# EAGLE design battery-board (EAGLE 6.5.0)
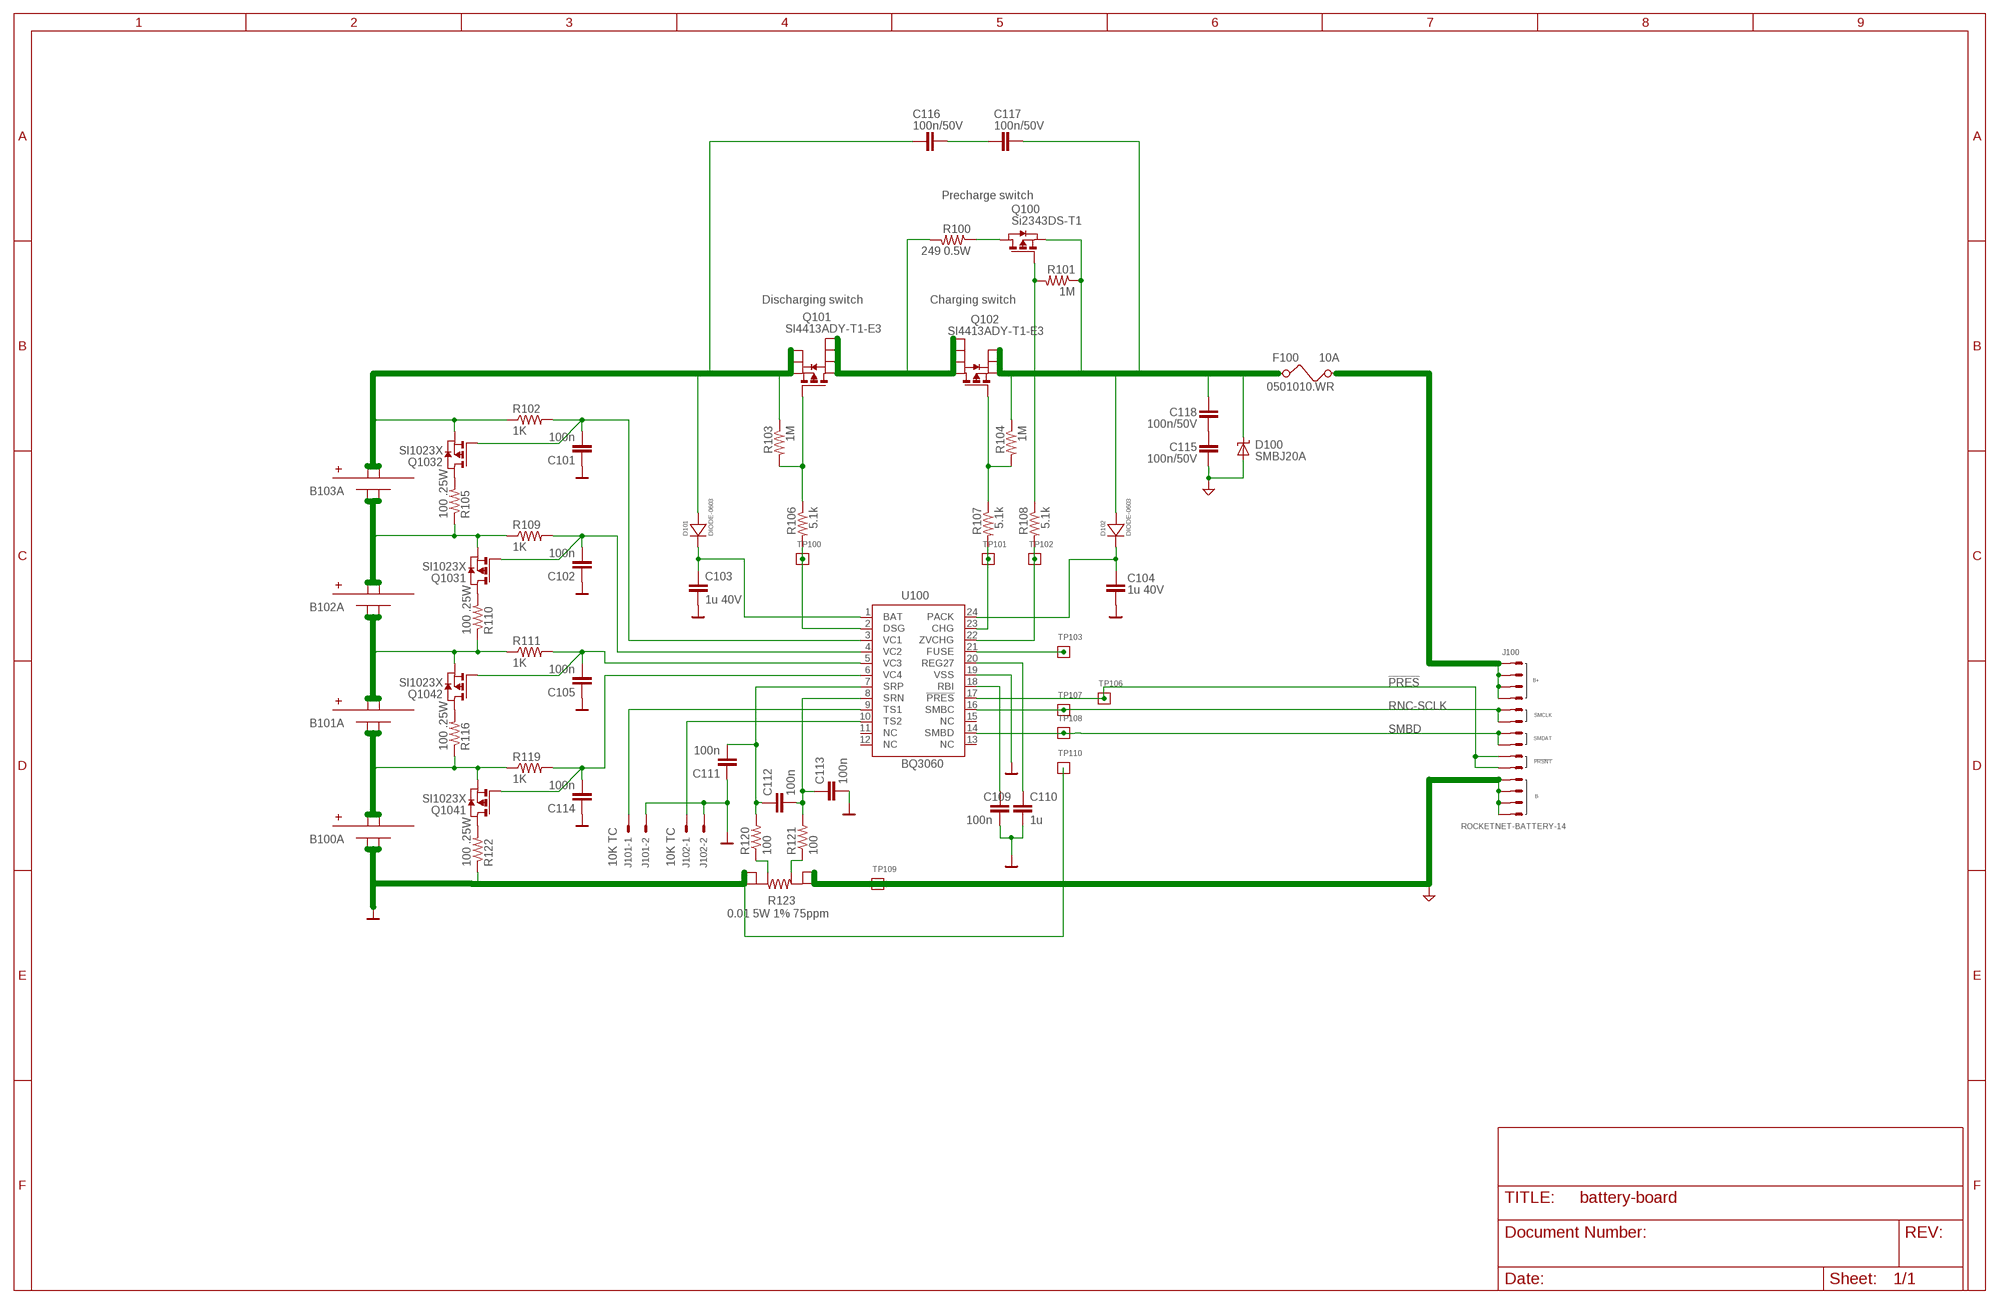
[diagram p0: schematic, sheet 1]

## Parts
B100A  LIPO-8AHR  [LIPO-8AHR-PAC]
B101A  LIPO-8AHR  [LIPO-8AHR-PAC]
B102A  LIPO-8AHR  [LIPO-8AHR-PAC]
B103A  LIPO-8AHR  [LIPO-8AHR-PAC]
C101  100n  C-EU0603-B-NOSILK  [0603-B-NOSILK]
C102  100n  C-EU0603-B-NOSILK  [0603-B-NOSILK]
C103  1u 40V  C-EU0603-B-NOSILK  [0603-B-NOSILK]
C104  1u 40V  C-EU0603-B-NOSILK  [0603-B-NOSILK]
C105  100n  C-EU0603-B-NOSILK  [0603-B-NOSILK]
C109  100n  C-EU0603-B-NOSILK  [0603-B-NOSILK]
C110  1u  C-EU0603-B-NOSILK  [0603-B-NOSILK]
C111  100n  C-EU0603-B-NOSILK  [0603-B-NOSILK]
C112  100n  C-EU0603-B-NOSILK  [0603-B-NOSILK]
C113  100n  C-EU0603-B-NOSILK  [0603-B-NOSILK]
C114  100n  C-EU0603-B-NOSILK  [0603-B-NOSILK]
C115  100n/50V  C-EU0603-B-NOSILK  [0603-B-NOSILK]
C116  100n/50V  C-EU0603-B-NOSILK  [0603-B-NOSILK]
C117  100n/50V  C-EU0603-B-NOSILK  [0603-B-NOSILK]
C118  100n/50V  C-EU0603-B-NOSILK  [0603-B-NOSILK]
D100  SMBJ20A  SUPPRESSOR-SMBJ  [SMBJ]
D101  DIODE-0603  [0603-B-NOSILK-DIODE]
D102  DIODE-0603  [0603-B-NOSILK-DIODE]
F100  0501010.WR  FUSE1206  [1206]
J100  ROCKETNET-BATTERY-14  [ROCKETNET-M-14]
J101  87758-0216  [87758-0216]
J102  87758-0216  [87758-0216]
Q100  Si2343DS-T1  NTR4101P  [SOT23]
Q101  SI4413ADY-T1-E3  SI4435DDY  [SO-8]
Q102  SI4413ADY-T1-E3  SI4435DDY  [SO-8]
Q103  SI1023X  [SOT-563]
Q104  SI1023X  [SOT-563]
R100  249 0.5W  R-US_1206-B  [1206-B]
R101  1M  R-US_0603-B-NOSILK  [0603-B-NOSILK]
R102  1K  R-US_0603-B-NOSILK  [0603-B-NOSILK]
R103  1M  R-US_0603-B-NOSILK  [0603-B-NOSILK]
R104  1M  R-US_0603-B-NOSILK  [0603-B-NOSILK]
R105  100 .25W  R-US_0603-B-NOSILK  [0603-B-NOSILK]
R106  5.1k  R-US_0603-B-NOSILK  [0603-B-NOSILK]
R107  5.1k  R-US_0603-B-NOSILK  [0603-B-NOSILK]
R108  5.1k  R-US_0603-B-NOSILK  [0603-B-NOSILK]
R109  1K  R-US_0603-B-NOSILK  [0603-B-NOSILK]
R110  100 .25W  R-US_0603-B-NOSILK  [0603-B-NOSILK]
R111  1K  R-US_0603-B-NOSILK  [0603-B-NOSILK]
R116  100 .25W  R-US_0603-B-NOSILK  [0603-B-NOSILK]
R119  1K  R-US_0603-B-NOSILK  [0603-B-NOSILK]
R120  100  R-US_0603-B-NOSILK  [0603-B-NOSILK]
R121  100  R-US_0603-B-NOSILK  [0603-B-NOSILK]
R122  100 .25W  R-US_0603-B-NOSILK  [0603-B-NOSILK]
R123  0.01 5W 1% 75ppm  R-US-2818  [VISHAY-2818]
TP100  TEST-POINT  [2MM-TEST-POINT]
TP101  TEST-POINT  [2MM-TEST-POINT]
TP102  TEST-POINT  [2MM-TEST-POINT]
TP103  TEST-POINT  [2MM-TEST-POINT]
TP106  TEST-POINT  [2MM-TEST-POINT]
TP107  TEST-POINT  [2MM-TEST-POINT]
TP108  TEST-POINT  [2MM-TEST-POINT]
TP109  TEST-POINT  [2MM-TEST-POINT]
TP110  TEST-POINT  [2MM-TEST-POINT]
U100  BQ3060PW  [PW-R-PDSO-G24]

## Nets
!PRES: J100.!PRSNT@9(!PRSNT) J100.!PRSNT@10(!PRSNT) TP106.1 U100.17(!PRES)
B12: B100A.B+@1(B+) B100A.B+@2(B+) B101A.B-@1(B-) B101A.B-@2(B-) Q104.1(1:S) R116.1 R119.1
B23: B101A.B+@1(B+) B101A.B+@2(B+) B102A.B-@1(B-) B102A.B-@2(B-) Q104.4(2:S) R110.1 R111.1
B34: B102A.B+@1(B+) B102A.B+@2(B+) B103A.B-@1(B-) B103A.B-@2(B-) Q103.1(1:S) R105.1 R109.1
B+: B103A.B+@1(B+) B103A.B+@2(B+) C116.1 D101.ANODE Q101.1(S) Q101.2(S) Q101.3(S) Q103.4(2:S) R102.1 R103.1
BAR_GND: B100A.B-@1(B-) B100A.B-@2(B-) C101.1 C102.1 C103.2 C104.2 C105.1 C109.2 C110.2 C111.1 C113.2 C114.1 J101.2 J102.2 R122.1 R123.1@1 R123.1@2 TP110.1 U100.19(VSS) ; supply symbol labelled SUP_GND_BAR
BAT: C103.1 D101.CATHODE U100.1(BAT)
FUSE: TP103.1 U100.21(FUSE)
N$3: R120.1 R123.K1
N$5: C111.2 C112.1 R120.2 U100.7(SRP)
N$6: C112.2 C113.1 R121.2 U100.8(SRN)
N$9: Q104.3(2:D) R116.2
N$10: C102.2 Q103.2(1:G) R109.2 U100.4(VC2)
N$11: C105.2 Q104.5(2:G) R111.2 U100.5(VC3)
N$12: C114.2 Q104.2(1:G) R119.2 U100.6(VC4)
N$13: C109.1 U100.18(RBI)
N$14: C110.1 U100.20(REG27)
N$15: C115.1 C118.2
N$16: R121.1 R123.K2
N$18: Q104.6(1:D) R122.2
N$19: C101.2 Q103.5(2:G) R102.2 U100.3(VC1)
N$20: Q103.6(1:D) R110.2
N$21: Q103.3(2:D) R105.2
N$27: R106.2 TP100.1 U100.2(DSG)
N$28: Q101.5(D) Q101.6(D) Q101.7(D) Q101.8(D) Q102.5(D) Q102.6(D) Q102.7(D) Q102.8(D) R100.2
N$29: R108.2 TP102.1 U100.22(ZVCHG)
N$30: R107.2 TP101.1 U100.23(CHG)
N$34: Q101.4(G) R103.2 R106.1
N$36: Q102.4(G) R104.2 R107.1
N$39: Q100.1(G) R101.2 R108.1
N$40: C116.2 C117.1
PACK: C104.1 D102.CATHODE U100.24(PACK)
PACK+: F100.1 J100.B+@1(B+) J100.B+@2(B+) J100.B+@3(B+) J100.B+@4(B+)
PACK+PREFUSE: C117.2 C118.1 D100.C D102.ANODE F100.2 Q100.2(S) Q102.1(S) Q102.2(S) Q102.3(S) R101.1 R104.1
PRE-CHARGE: Q100.3(D) R100.1
RNC-SCLK: J100.SMCLK@3(SMCLK) J100.SMCLK@4(SMCLK) TP107.1 U100.16(SMBC)
SMBD: J100.SMDAT@7(SMDAT) J100.SMDAT@8(SMDAT) TP108.1 U100.14(SMBD)
T1: J101.1 U100.9(TS1)
T2: J102.1 U100.10(TS2)
TRIANGLE_GND: C115.2 D100.A J100.B-@11(B-) J100.B-@12(B-) J100.B-@13(B-) J100.B-@14(B-) R123.2@1 R123.2@2 TP109.1 ; supply symbol labelled SUP_GND_TRIANGLE
Unconnected: U100.11(NC) U100.12(NC) U100.13(NC) U100.15(NC)

## Notes on the sheet
- Precharge switch
- Discharging switch | Charging switch
- 10A
- 10K TC | 10K TC

## Library data of the parts
B100A B101A B102A B103A = battery:LIPO-8AHR
C101-C105 C109-C118 = rcl_custom:C-EU: CAPACITOR, European symbol
D100 = diode:SUPPRESSOR-: Suppressor diode
D101 D102 = diode-0603:DIODE-0603
F100 = psas:FUSE: Fuse; DK: F2919CT-ND
J100 = rocketnet-connector:ROCKETNET-BATTERY-14
J101 J102 = con-molex:87758-0216: 2 Pin - 2mm Dual Row Single Wafer, Vertical T/H HDR Source: http://www.molex.com/pdm_docs/sd/877580616_sd.pdf; MPN: 87758-0216; OC_FARNELL: unknown; OC_NEWARK: 94M1513
Q100 = Tova:NTR4101P
Q101 Q102 = si4435ddy:SI4435DDY
Q103 Q104 = si1023x:SI1023X
R100-R111 R116 R119-R122 = rcl_custom:R-US_: RESISTOR, American symbol
R123 = shunt:R-US-2818
TP100-TP103 TP106-TP110 = Tova:TEST-POINT
U100 = bq3060:BQ3060

## Board
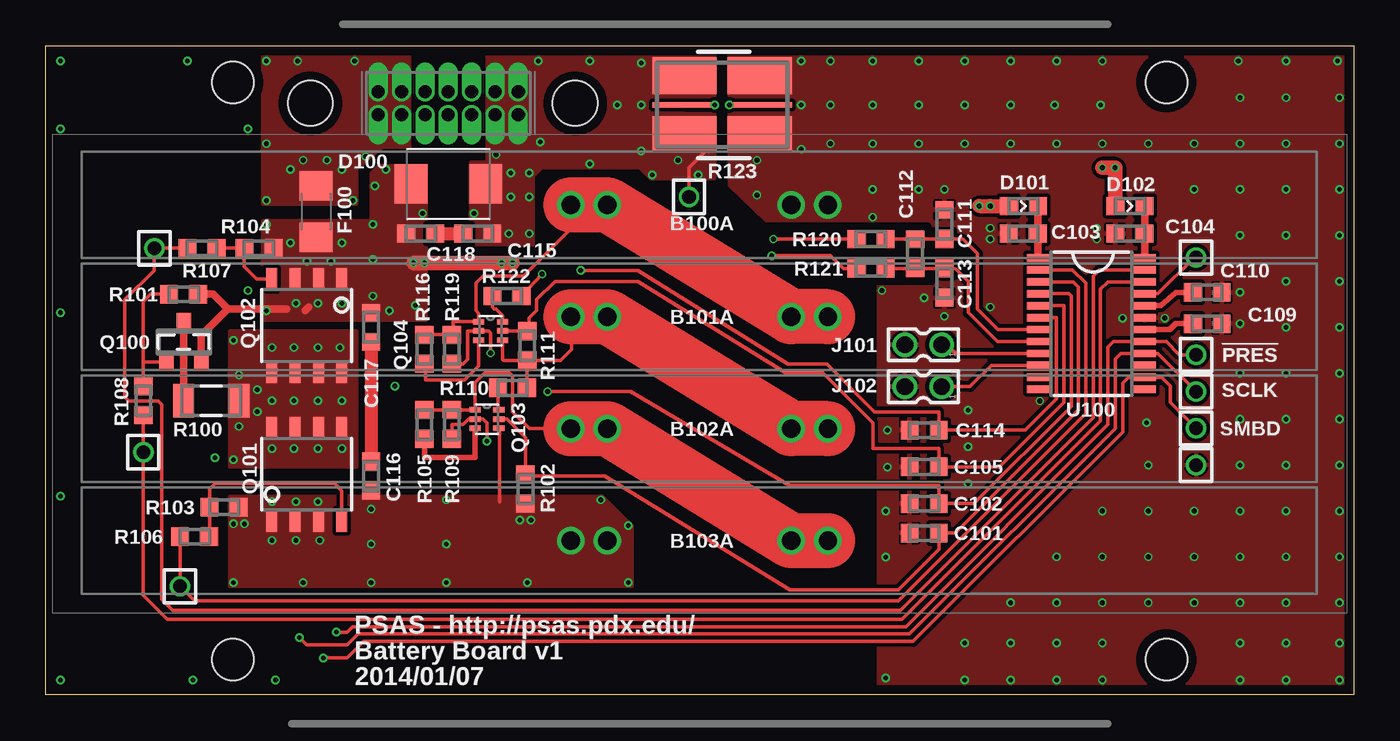
[diagram p1: board, top side]
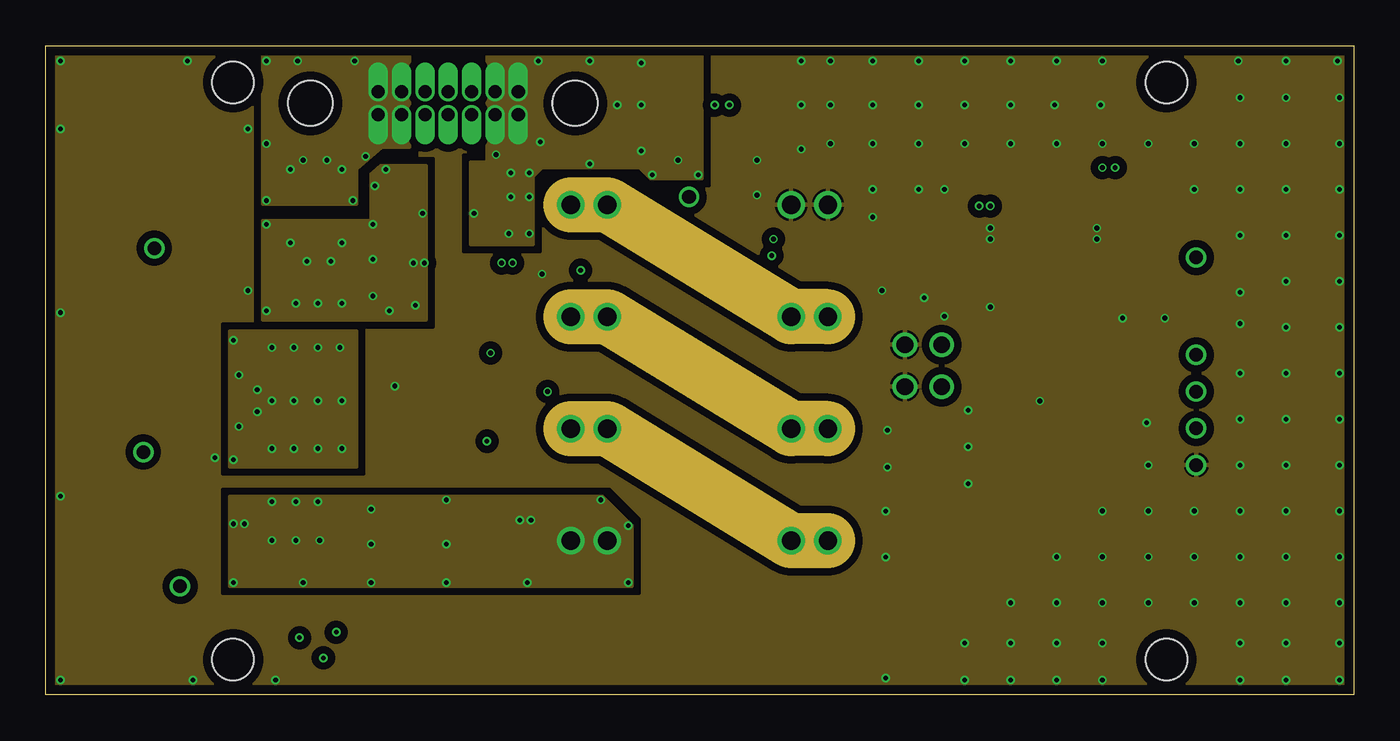
[diagram p2: board, inner layer Route2]
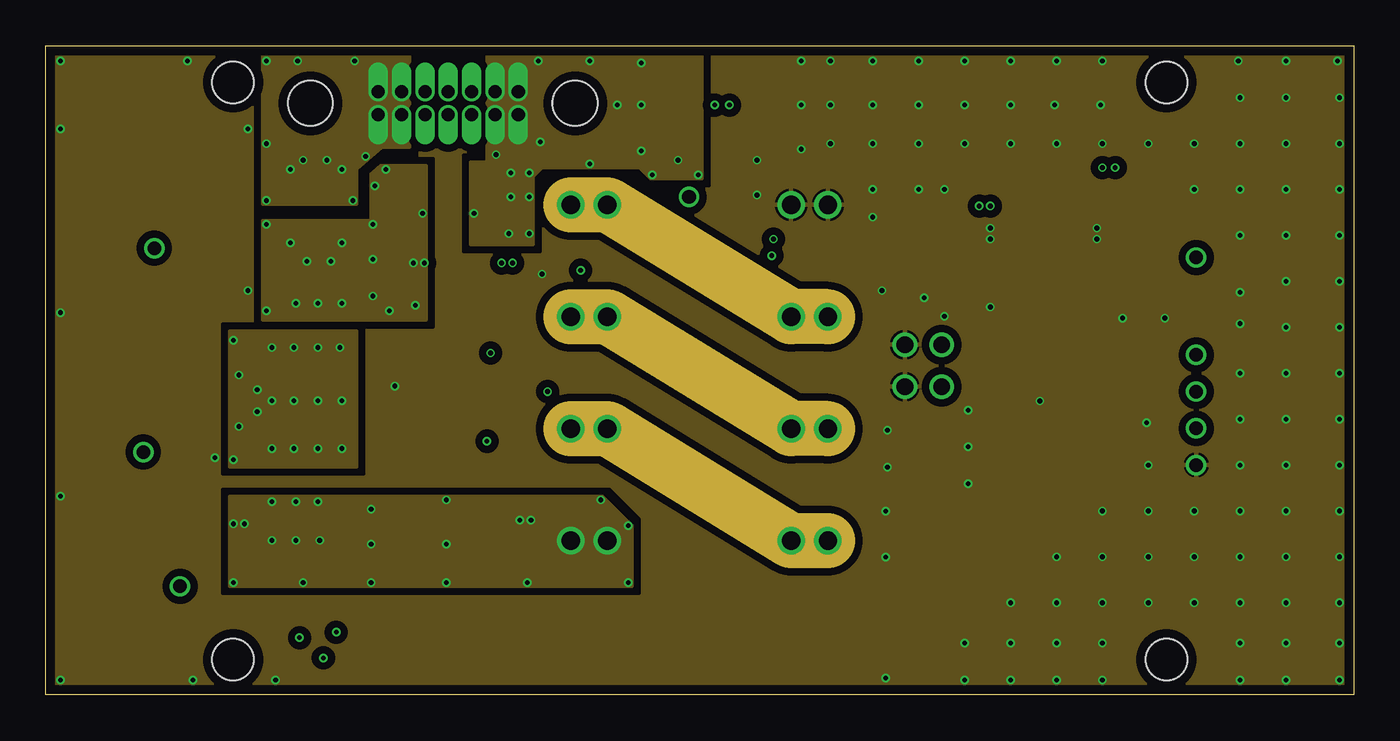
[diagram p3: board, inner layer Route3]
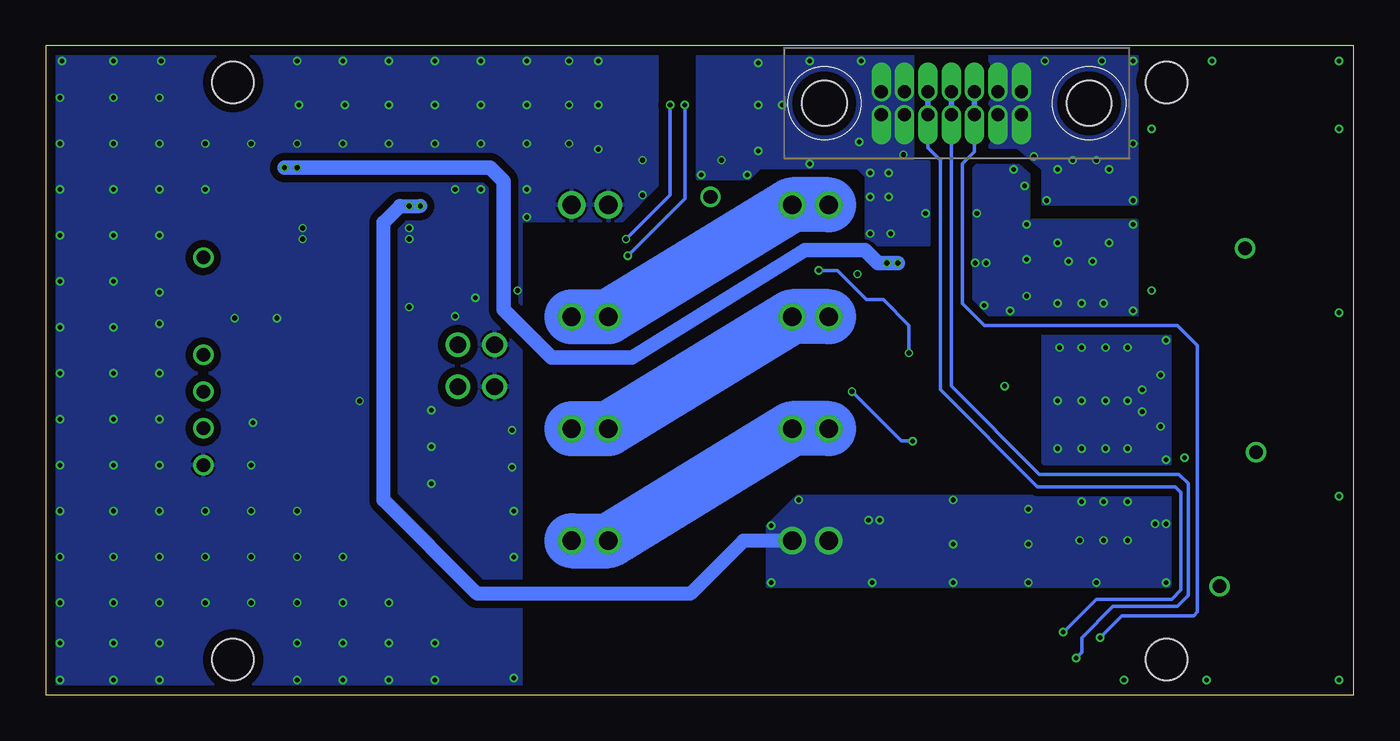
[diagram p4: board, bottom side, seen from below]

Size 71.17 x 35.32 mm. Coordinates in mm from the lower left corner, seen from the top.
Outline: 0,0 0,35.32 71.17,35.32 71.17,0 0,0
Copper layers (1+2*3+16): Top 0.035559375mm / dielectric 0.17018125mm / Route2 0.01778125mm / dielectric 47mil / Route3 0.01778125mm / dielectric 0.17018125mm / Bottom 0.035559375mm
Design rules "OSH-Park-4-layer *": minimum track width 5mil, minimum drill 10mil, track to track 5mil, track to pad 5mil, pad to pad 5mil, via to via 5mil, smd to smd 5mil, copper to edge 20mil, drill to drill 5mil, minimum pad ring 4mil, minimum via ring 4mil, stop-mask expansion 4mil, vias tented up to drill 10mil, thermal gap 5mil
Holes 2.26 mm at 60.99,1.91 10.19,1.91 60.99,33.34 10.19,33.34
tKeepout: area 59,31.3 to 63,35.4; area 8.2,31.3 to 12.2,35.4; area 8.2,-0.1 to 12.2,3.9; area 59,-0.1 to 63,3.9
bKeepout: area 0,30.5 to 71.2,35.2; area 0,0 to 71.2,4.4
tRestrict: area 44.6,25.4 to 48,25.5; area 44.8,22.5 to 48.2,22.6

### Footprints (pad centres in the part's own frame; a part is rotated, then mirrored left to right if it is on the bottom)
LIPO-8AHR-PAC = drill 1: B+@1 5,0; B+@2 7,0; B-@1 -5,0; B-@2 -7,0
0603-B-NOSILK = smd 0.95 x 1: 1 -0.8,0; 2 0.8,0
SMBJ = smd 1.78 x 2.16: A 2.04,0; C -2.03,0
0603-B-NOSILK-DIODE = smd 0.95 x 1: ANODE -0.8,0; CATHODE 0.8,0
1206 = smd 1.6 x 1.8: 1 -1.4,0; 2 1.4,0
ROCKETNET-M-14 = drill 0.71 pad 0.95 offset: !PRSNT@9 1.27,-0.635; !PRSNT@10 1.27,0.635; B+@1 -3.81,-0.635; B+@2 -3.81,0.635; B+@3 -2.54,-0.635; B+@4 -2.54,0.635; B-@11 2.54,-0.635; B-@12 2.54,0.635; B-@13 3.81,-0.635; B-@14 3.81,0.635; SMCLK@3 -1.27,-0.635; SMCLK@4 -1.27,0.635; SMDAT@7 0,-0.635; SMDAT@8 0,0.635 | hole 2.438: 6.9,0; -7.5,0
87758-0216 = drill 0.9 pad 1.27: 1 0,-1; 2 0,1
SOT23 = smd 0.787 x 0.889: 1 -0.953,-1.143; 2 0.953,-1.143; 3 0,1.143
SO-8 = smd 0.6 x 1.2: 1 -1.905,-2.527; 2 -0.635,-2.527; 3 0.635,-2.527; 4 1.905,-2.527; 5 1.905,2.527; 6 0.635,2.527; 7 -0.635,2.527; 8 -1.905,2.527
SOT-563 = smd 0.3 x 0.6: 1 -0.5,-0.65; 2 0,-0.65; 3 0.5,-0.65; 4 0.5,0.65; 5 0,0.65; 6 -0.5,0.65
1206-B = smd 1.15 x 1.8: 1 -1.5,0; 2 1.5,0
VISHAY-2818 = smd 3.5 x 2: 1@1 -2.055,-1.6; 1@2 -2.055,1.6; 2@1 2.045,-1.6; 2@2 2.045,1.6 | smd 3.5 x 0.3: K1 -2.055,0; K2 2.045,0
2MM-TEST-POINT = drill 0.737: 1 0,0
PW-R-PDSO-G24 = smd 0.4 x 1.2: 1 -3.575,-2.9; 2 -2.925,-2.9; 3 -2.275,-2.9; 4 -1.625,-2.9; 5 -0.975,-2.9; 6 -0.325,-2.9; 7 0.325,-2.9; 8 0.975,-2.9; 9 1.625,-2.9; 10 2.275,-2.9; 11 2.925,-2.9; 12 3.575,-2.9; 13 3.575,2.9; 14 2.925,2.9; 15 2.275,2.9; 16 1.625,2.9; 17 0.975,2.9; 18 0.325,2.9; 19 -0.325,2.9; 20 -0.975,2.9; 21 -1.625,2.9; 22 -2.275,2.9; 23 -2.925,2.9; 24 -3.575,2.9

### Placement (x,y rotation side)
B100A  35.56,26.67 180 top
B101A  35.56,20.57 180 top
B102A  35.56,14.48 180 top
B103A  35.56,8.38 180 top
C101  47.8,8.8 0 top
C102  47.8,10.4 0 top
C103  53.2,25.1 180 top
C104  59,25.1 180 top
C105  47.8,12.4 0 top
C109  63.2,20.2 0 top
C110  63.2,21.9 0 top
C111  48.9,25.6 270 top
C112  47.3,24 270 top
C113  48.9,22.4 270 top
C114  47.8,14.4 0 top
C115  23.5,25.1 0 top
C116  17.7,11.9 90 top
C117  17.7,20 90 top
C118  20.4,25.1 0 top
D100  21.9,27.8 0 top
D101  53.2,26.6 0 top
D102  59,26.6 0 top
F100  14.7,26.3 270 top
J100  21.9,32.2 0 top
J101  47.75,19.05 90 top
J102  47.75,16.76 90 top
Q100  7.5,19.2 0 top
Q101  14.2,12 0 top
Q102  14.2,20.1 180 top
Q103  24,15 270 top
Q104  24.2,19.8 270 top
R100  9,16 0 top
R101  7.5,21.8 180 top
R102  26.1,11.2 90 top
R103  9.7,10.2 180 top
R104  11.6,24.3 180 top
R105  20.6,14.7 270 top
R106  8.1,8.6 180 top
R107  8.5,24.3 180 top
R108  5.3,16 270 top
R109  22.1,14.7 270 top
R110  25.4,16.7 180 top
R111  26.2,19 90 top
R116  20.6,18.8 270 top
R119  22.1,18.8 270 top
R120  44.9,24.8 0 top
R121  44.9,23.2 0 top
R122  25.1,21.7 180 top
R123  36.8,32.1 180 top
TP100  7.3,5.9 0 top
TP101  5.9,24.3 0 top
TP102  5.3,13.2 0 top
TP103  62.6,23.8 0 top
TP106  62.6,18.5 0 top
TP107  62.6,16.5 0 top
TP108  62.6,14.5 0 top
TP109  35,27.1 0 top
TP110  62.6,12.5 0 top
U100  56.9,20.2 270 top

### Tracks (layer width: path | path; a pad name or v marks a point on that pad's centre or on a via)
!PRES  (via drill 0.25)
  Top 0.2: 57.8,14.7 46.8,3.7 16.7,3.7 16.4,3.4 v15.8,3.4
  Top 0.203: TP106.1 61.7,18.5 60.98,19.23 U100.17 58.1,19.23 57.8,18.93 57.8,14.7
  Bottom 0.203: J100.!PRSNT@9 23.17,29.77 22.5,29.1 22.5,16.6 17.2,11.3 9.7,11.3 9.4,11 9.4,5.7 9.9,5.2 14,5.2 v15.8,3.4
  Bottom 0.3: J100.!PRSNT@10 J100.!PRSNT@9
B12
  Top 0.2: 22.16,20.3 22.16,19.66 R119.1
  Top 0.203: 22.13,19.6 R119.1 R116.1 | 22.16,20.3 Q104.1 23.55,20.75 23.4,20.9 23.4,22.4 23.8,22.8 26,22.8 28.6,25.4 28.56,25.4 B100A.B+@2
  Top 3: B101A.B-@2 B101A.B-@1 B100A.B+@1 B100A.B+@2
  Route2 3: B100A.B+@2 B100A.B+@1 B101A.B-@1 B101A.B-@2
  Route3 3: B100A.B+@2 B100A.B+@1 B101A.B-@1 B101A.B-@2
  Bottom 3: B100A.B+@2 B100A.B+@1 B101A.B-@1 B101A.B-@2
B23
  Top 0.203: 24.85,18.35 Q104.4 24.85,18.3 arc90 24.95,18.2 R111.1 | R111.1 28,18.2 28.6,18.8 28.6,20.53 B101A.B+@2 | R110.1 R111.1
  Top 3: B102A.B-@2 B102A.B-@1 B101A.B+@1 B101A.B+@2
  Route2 3: B101A.B+@2 B101A.B+@1 B102A.B-@1 B102A.B-@2
  Route3 3: B101A.B+@2 B101A.B+@1 B102A.B-@1 B102A.B-@2
  Bottom 3: B101A.B+@2 B101A.B+@1 B102A.B-@1 B102A.B-@2
B34
  Top 0.203: R105.1 R109.1 Q103.1 23.35,17 23.87,17.52 25.24,17.52 25.4,17.36 25.4,15.4 26.32,14.48 B102A.B+@2
  Top 3: B103A.B-@2 B103A.B-@1 B102A.B+@1 B102A.B+@2
  Route2 3: B103A.B-@2 B103A.B-@1 B102A.B+@1 B102A.B+@2
  Route3 3: B103A.B-@2 B103A.B-@1 B102A.B+@1 B102A.B+@2
  Bottom 3: B103A.B-@2 B103A.B-@1 B102A.B+@1 B102A.B+@2
B+  (via drill 0.25)
  Top 0.203: R102.1 26.1,10.6 26.2,10.5 | Q103.4 24.7,14.45 24.7,10.5
  Top 0.762: v50.8,26.6 v51.4,26.6 D101.ANODE
  Bottom 0.762: B103A.B+@1 33.22,8.38 36.1,5.5 47.7,5.5 52.8,10.6 52.8,25.7 51.9,26.6 v50.8,26.6
  other vias: 10.2,9.3 10.8,9.3 31.7,9.2 31.7,6.1 26.4,9.5 25.8,9.5 10.2,6.1 14.9,8.4 14.8,10.5 13.6,8.4 13.6,10.5 12.3,8.4 12.3,10.5 17.7,10.1 14,6.1 17.7,6.1 21.8,6.1 26.2,6.1 21.8,10.6 21.8,8.2 17.7,8.2 30.2,10.6
  pour Top (isolate 0.2, no thermals): 10,5.9 10,10.8 30.3,10.8 31.9,9.2 31.9,5.9
  pour Route2 (isolate 0.4, rank 3, no thermals): 10,5.9 10,10.8 30.3,10.8 31.9,9.2 31.9,5.9
  pour Route3 (isolate 0.4, rank 3, no thermals): 10,5.9 10,10.8 30.3,10.8 31.9,9.2 31.9,5.9
  pour Bottom (isolate 0.4, no thermals): 10,5.9 10,10.8 30.3,10.8 31.9,9.2 31.9,5.9
BAR_GND  (via drill 0.25)
  Top 0.203: R122.1 v27,22.9
  other vias: 59.9,14.8 51.4,24.8 45.7,0.9 45.7,7.49 45.8,12.39 45.8,14.39 42.7,32.1 45,32.1 47.5,32.1 50,32.1 52.5,32.1 54.9,32.1 57.4,32.1 65,32.5 67.5,32.5 67.5,30 65,30 62.5,30 60,30 57.5,30 55,30 52.5,30 50,30 47.5,30 45,30 42.7,30 45,27.5 47.5,27.5 62.5,27.5 65,27.5 67.5,27.5 67.5,25 65,25 67.5,22.5 67.5,20 58.6,20.5 67.5,17.5 65,17.5 65,15 67.5,15 67.5,12.5 65,12.5 60,12.5 57.5,10 60,10 62.5,10 65,10 67.5,10 67.5,7.5 65,7.5 62.5,7.5 60,7.5 57.5,7.5 55,7.5 52.5,5 55,5 57.5,5 60,5 62.5,5 65,5 67.5,5 67.5,2.8 65,2.8 57.5,2.8 55,2.8 52.5,2.8 50,2.8 45.7,9.99 50.2,15.49 50.2,13.49 50.2,11.49 45.5,22 48.9,20.6 57.2,25.4 65,21.9 65,20.2 57.2,24.8 51.4,25.4 60.9,20.5 48.9,27.5 41.1,34.5 42.7,34.5 45,34.5 41.1,32.1 41.1,29.7 38.7,29.1 0.8,0.8 0.8,34.5 7.7,34.5 11,30.8 19,16.8 8,0.8 12.5,0.8 47.5,34.5 50,34.5 52.5,34.5 55,34.5 57.5,34.5 45,26 38.7,27.2 64.9,34.5 67.5,34.5 70.3,34.5 70.4,32.5 70.4,30 70.4,27.5 70.4,25 70.4,22.5 70.4,20 70.4,17.5 70.4,15 70.4,12.5 70.4,10 70.4,7.5 70.4,5 70.4,2.8 67.5,0.8 65,0.8 57.5,0.8 55,0.8 52.5,0.8 50,0.8 70.4,0.8 54.1,15.99 47.8,21.6 51.4,21.1 11,22 9.2,12.9 0.8,10.8 0.8,20.8 0.8,30.8
  pour Route2 (isolate 0.4, rank 6): 0,35.3 0,0 71.2,0 71.2,35.32
  pour Top (isolate 0.2, no thermals): 39.2,27.7 43.7,27.7 43.7,25.8 39.2,25.8
  pour Route3 (isolate 0.4, rank 6): 71.2,35.3 0,35.3 0,0 71.2,0
  pour Top (isolate 0.2, rank 6): 39.2,25.8 40.32,25.81 arc0 45.3,25.8 45.3,0 71.2,0 71.2,35.3 37.2,35.3 37.2,27.7
  pour Bottom (isolate 0.4, rank 6): 39.8,25.8 40.32,25.81 45.3,25.8 45.3,0 71.2,0 71.2,35.3 37.9,35.3 37.9,27.7
BAT
  Top 0.4: D101.CATHODE C103.1 U100.1
FUSE
  Top 0.203: U100.21 60.52,21.82 62.5,23.8
  Top 0.254: 62.5,23.8 TP103.1
N$3  (via drill 0.25)
  Top 0.203: v39.6,24.8 R120.1
  Top 0.3: R123.K1 v37.2,32.1
  Bottom 0.203: v37.2,32.1 37.2,27.2 v39.6,24.8
N$5
  Top 0.2: 50.7,24 50.7,21 51.83,19.88 U100.7
  Top 0.203: R120.2 C112.1 C111.2 49.9,24.8 50.7,24
N$6
  Top 0.2: 47.68,23.2 C112.2 | 48.86,23.22 C113.1 | 50.2,22.5 50.2,20.8 51.77,19.23 U100.8
  Top 0.203: 50.2,22.5 49.52,23.18 C113.1 C112.2 R121.2
N$9
  Top 0.203: Q104.3 23.55,17.89 22.78,17.12 20.66,17.12 20.66,17.94 R116.2
N$10  (via drill 0.25)
  Top 0.203: U100.4 55.67,21.82 55.8,21.7 55.8,15.7 50.5,10.4 C102.2 48.6,11.4 40.48,11.4 31.82,16.5 v27.3,16.5 | R109.2 22.1,14.7 22.7,14.7 23,15 Q103.2 23.8,15 24,14.8 v24,13.8
  Bottom 0.203: v27.3,16.5 24.6,13.8 v24,13.8
N$11
  Top 0.203: U100.5 55.4,21.18 55.4,15.9 51.9,12.4 C105.2 48.6,13.4 45,13.4 45,14.8 42.3,17.5 40.28,17.5 32.23,22.5 27.7,22.5 26.7,21.5 26.7,20.9 26.3,20.5 26.3,19.9 R111.2 Q104.5
N$12  (via drill 0.25)
  Top 0.2: 22.95,19.8 22.95,18.25 22.7,18 R119.2
  Top 0.203: v29.1,23.1 32.23,23.1 40.38,18 42.5,18 45.1,15.4 48.6,15.4 C114.2 53.3,14.4 55,16.1 55,20.52 U100.6 | v24.2,18.6 24.2,19.7 24.1,19.8 Q104.2 22.95,19.8
  Bottom 0.203: v24.2,18.6 24.2,20.1 25.6,21.5 26.5,21.5 28.1,23.1 v29.1,23.1
N$13
  Top 0.3: U100.18 61.17,19.88 61.5,20.2 C109.1
N$14
  Top 0.3: U100.20 60.67,21.18 61.5,21.9 C110.1
N$15
  Top 0.7: C118.2 C115.1
N$16  (via drill 0.25)
  Top 0.203: v39.5,23.9 42.7,23.9 43.4,23.2 R121.1
  Top 0.3: R123.K2 v36.4,32.1
  Bottom 0.203: v36.4,32.1 36.4,27 v39.5,23.9
N$18
  Top 0.203: Q104.6 24.85,20.65 24.5,21 24.4,21 24.3,21.1 R122.2
N$19
  Top 0.2: 46.4,5.7 48.6,7.9 C101.2 49.5,8.8 56.2,15.5
  Top 0.203: 46.4,5.7 40.5,5.7 30.4,11.9 26.2,11.9 R102.2 26.1,14 25.1,15 Q103.5 | 56.2,15.5 56.2,22.2 55.92,22.48 U100.3
N$20
  Top 0.203: 24.65,16.95 R110.2 24.6,15.5 Q103.6
N$21
  Top 0.3: R105.2 20.6,12.9 23.35,12.9 Q103.3
N$27
  Top 0.2: R106.2 TP100.1 8.1,5.1 46.4,5.1 56.6,15.3
  Top 0.203: U100.2 55.88,23.12 56.6,22.4 56.6,15.3
N$28  (via drill 0.25)
  other vias: 10.5,14.6 14.8,13.4 13.5,13.4 12.3,13.4 10.5,17.4 14.8,16 16.1,13.4 10.2,19.3 10.2,12.8 11.5,16.6 11.5,15.4 16.1,16 13.5,16 12.3,16 16,18.9 14.8,18.9 13.5,18.9 12.3,18.9
  pour Top (isolate 0.2, rank 3, no thermals): 16.9,12.4 10,12.4 10,19.8 16.9,19.8
  pour Route2 (isolate 0.4, rank 4, no thermals): 16.9,12.4 10,12.4 10,19.8 16.9,19.8
  pour Route3 (isolate 0.4, rank 2, no thermals): 16.9,12.4 10,12.4 10,19.8 16.9,19.8
  pour Bottom (isolate 0.4, rank 3, no thermals): 16.9,12.4 10,12.4 10,19.8 16.9,19.8
N$29
  Top 0.2: R108.2 TP102.1 5.3,5.4 6.6,4.1 46.6,4.1 57.4,14.9
  Top 0.203: U100.22 57.8,22.48 57.4,22.07 57.4,14.9
N$30
  Top 0.2: 46.3,4.6 6.9,4.6 6.3,5.2 6.3,15.8 6.1,16 4.5,16 4.3,16.2 4.3,21.5 5.9,23.1 TP101.1 R107.2 | 57,15.1 46.5,4.6
  Top 0.203: U100.23 57.33,23.12 57,22.8 57,15.1 | 46.5,4.6 46.3,4.6
N$34
  Top 0.2: Q101.4 16.11,11.1 15.7,11.5 9.2,11.5 8.9,11.2 R103.2 R106.1
N$36
  Top 0.2: Q102.4 11.47,22.63 10.8,23.3 R104.2 R107.1
N$39
  Top 0.2: R101.2 5.7,21.8 5.3,21.4 5.3,18.1 | 5.3,18.1 6.5,18.1 Q100.1 | R108.1 5.3,18.1
N$40
  Top 0.7: C117.1 C116.2
PACK
  Top 0.4: U100.24 C104.1 D102.CATHODE
PACK+  (via drill 0.25)
  other vias: 17.4,29.3 15.3,29.1 14,29.1 12,34.5 12,30 12,26.9 16.7,26.9 13.3,28.6 16.1,28.6 13.7,34.5 16.8,34.5
  pour Top (isolate 0.2, no thermals): 19.8,29.8 19.8,35.3 11.8,35.3 11.8,26.7 16.9,26.7 16.9,28.6 18.3,29.8
  pour Bottom (isolate 0.4, no thermals): 19.8,29.8 19.8,35.3 11.8,35.3 11.8,26.7 16.9,26.7 16.9,28.6 18.3,29.8
  pour Route2 (isolate 0.4, rank 2, no thermals): 19.8,29.8 19.8,35.3 11.8,35.3 11.8,26.7 16.9,26.7 16.9,28.6 18.3,29.8
  pour Route3 (isolate 0.4, rank 2, no thermals): 19.8,29.8 19.8,35.3 11.8,35.3 11.8,26.7 16.9,26.7 16.9,28.6 18.3,29.8
PACK+PREFUSE  (via drill 0.25)
  Top 0.4: 14.1,20.9 14.3,21.1 | 9.9,21 9.8,21 9.8,21.1 9.1,21.8 R101.1 | 9.9,21 13.1,21 | Q100.2 8.45,19.55 9.9,21
  Top 0.8: v20,23.5 v24.8,23.5 v25.4,23.5 | D102.ANODE v58.2,28.69 v57.5,28.69
  Bottom 0.762: v58.19,28.7 v58.2,28.69
  Bottom 0.8: v24.8,23.5 25.9,23.5 26.6,24.2 29.85,24.2 39.26,18.35 43.65,18.35 46.26,20.96 46.26,27.95 47.01,28.7 v58.19,28.7
  other vias: 17.8,21.7 12,25.6 20.5,26.2 18.7,20.9 15.5,23.6 12,20.9 20.6,23.5 17.8,23.7 18.5,28.6 17.8,25.6 14.2,23.6 14.8,21.3 13.6,21.3 17.9,27.7 13.3,24.6 16.1,24.6 20.1,21.2 16.1,21.3
  pour Top (isolate 0.2, rank 3, no thermals): 11.8,25.8 11.8,20.4 20.7,20.4 20.7,28.8 18.1,28.8 17.7,28.4 17.7,25.8
  pour Route2 (isolate 0.4, rank 3, no thermals): 11.8,25.8 11.8,20.4 20.7,20.4 20.7,28.8 18.1,28.8 17.7,28.4 17.7,25.8
  pour Route3 (isolate 0.4, rank 3, no thermals): 11.8,25.8 11.8,20.4 20.7,20.4 20.7,28.8 18.1,28.8 17.7,28.4 17.7,25.8
  pour Bottom (isolate 0.4, rank 3, no thermals): 11.8,25.8 11.8,20.4 20.7,20.4 20.7,28.8 18.1,28.8 17.7,28.4 17.7,25.8
PRE-CHARGE
  Top 0.4: R100.1 Q100.3
RNC-SCLK  (via drill 0.25)
  Top 0.2: 58.2,14.5 47,3.3 17,3.3 16.4,2.7 14.2,2.7 v13.8,3.1
  Top 0.203: TP107.1 60.52,18.57 U100.16 58.5,18.57 58.2,18.27 58.2,14.5
  Bottom 0.203: J100.SMCLK@3 20.63,29.57 21.3,28.9 21.3,21.3 20.1,20.1 9.6,20.1 8.5,19 8.5,4.5 8.7,4.3 12.6,4.3 v13.8,3.1
  Bottom 0.3: J100.SMCLK@4 J100.SMCLK@3
SMBD  (via drill 0.25)
  Top 0.2: 58.6,14.3 47.2,2.9 17.3,2.9 16.4,2 v15.1,2
  Top 0.203: TP108.1 61.2,15.9 61.2,16.8 60.73,17.27 U100.14 58.9,17.27 58.6,16.98 58.6,14.3
  Bottom 0.203: J100.SMDAT@7 21.9,16.8 17.1,12 10,12 9.9,12 9.5,12 9,11.5 9,5.4 9.6,4.8 13.1,4.8 14.8,3.1 14.8,2.3 v15.1,2
  Bottom 0.3: J100.SMDAT@8 J100.SMDAT@7
T1
  Top 0.203: 53.65,18.57 49.59,18.57 48.77,19.05 J101.1
  Top 0.254: U100.9 53.65,18.57
T2
  Top 0.203: J102.1 50.29,16.76 51.45,17.93 U100.10
TRIANGLE_GND  (via drill 0.25)
  Top 0.2: 36.07,29.57 36.1,29.6
  Top 0.203: TP109.1 35,28.7 35.9,29.6 36.05,29.6 36.07,29.57
  other vias: 32.4,34.4 32.4,32.1 25.2,25.1 25.3,27.1 25.3,28.4 33,28.3 32.4,29.6 26.3,25.1 24.5,29.4 23.3,26.2 29.6,28.9 35.5,28.3 26.3,27.1 26.3,28.4 26.8,34.5 26.9,30.1 29.6,34.5 34.4,29.1 31.1,32.1
  pour Top (isolate 0.2, rank 3, no thermals): 24,35.3 24,29 23.1,29 23.1,24.5 26.5,24.5 26.5,28.2 27,28.7 32.3,28.7 32.9,28.1 36.4,28.1 36.4,35.3
  pour Route2 (isolate 0.4, rank 3, no thermals): 24,35.3 24,29 23.1,29 23.1,24.5 26.5,24.5 26.5,28.2 27,28.7 32.3,28.7 32.9,28.1 35.7,28.1 35.7,35.3
  pour Route3 (isolate 0.4, rank 2, no thermals): 24,35.3 24,29 23.1,29 23.1,24.5 26.5,24.5 26.5,28.2 27,28.7 32.3,28.7 32.9,28.1 35.7,28.1 35.7,35.3
  pour Bottom (isolate 0.2, rank 3, no thermals): 24,35.3 24,29 23.1,29 23.1,24.5 26.5,24.5 26.5,28.2 27,28.7 32.3,28.7 32.9,28.1 35.7,28.1 35.7,35.3

### Text on the board
tPlace: !PRES | SCLK | SMBD | PSAS - http://psas.pdx.edu/ | Battery Board v1 | 2014/01/07